# EasyEDA Pro project ProPrj_HTXStudio_OneHanded_Keyboard.epro, schematic 键盘轴_ML

## Sheets
1 keys
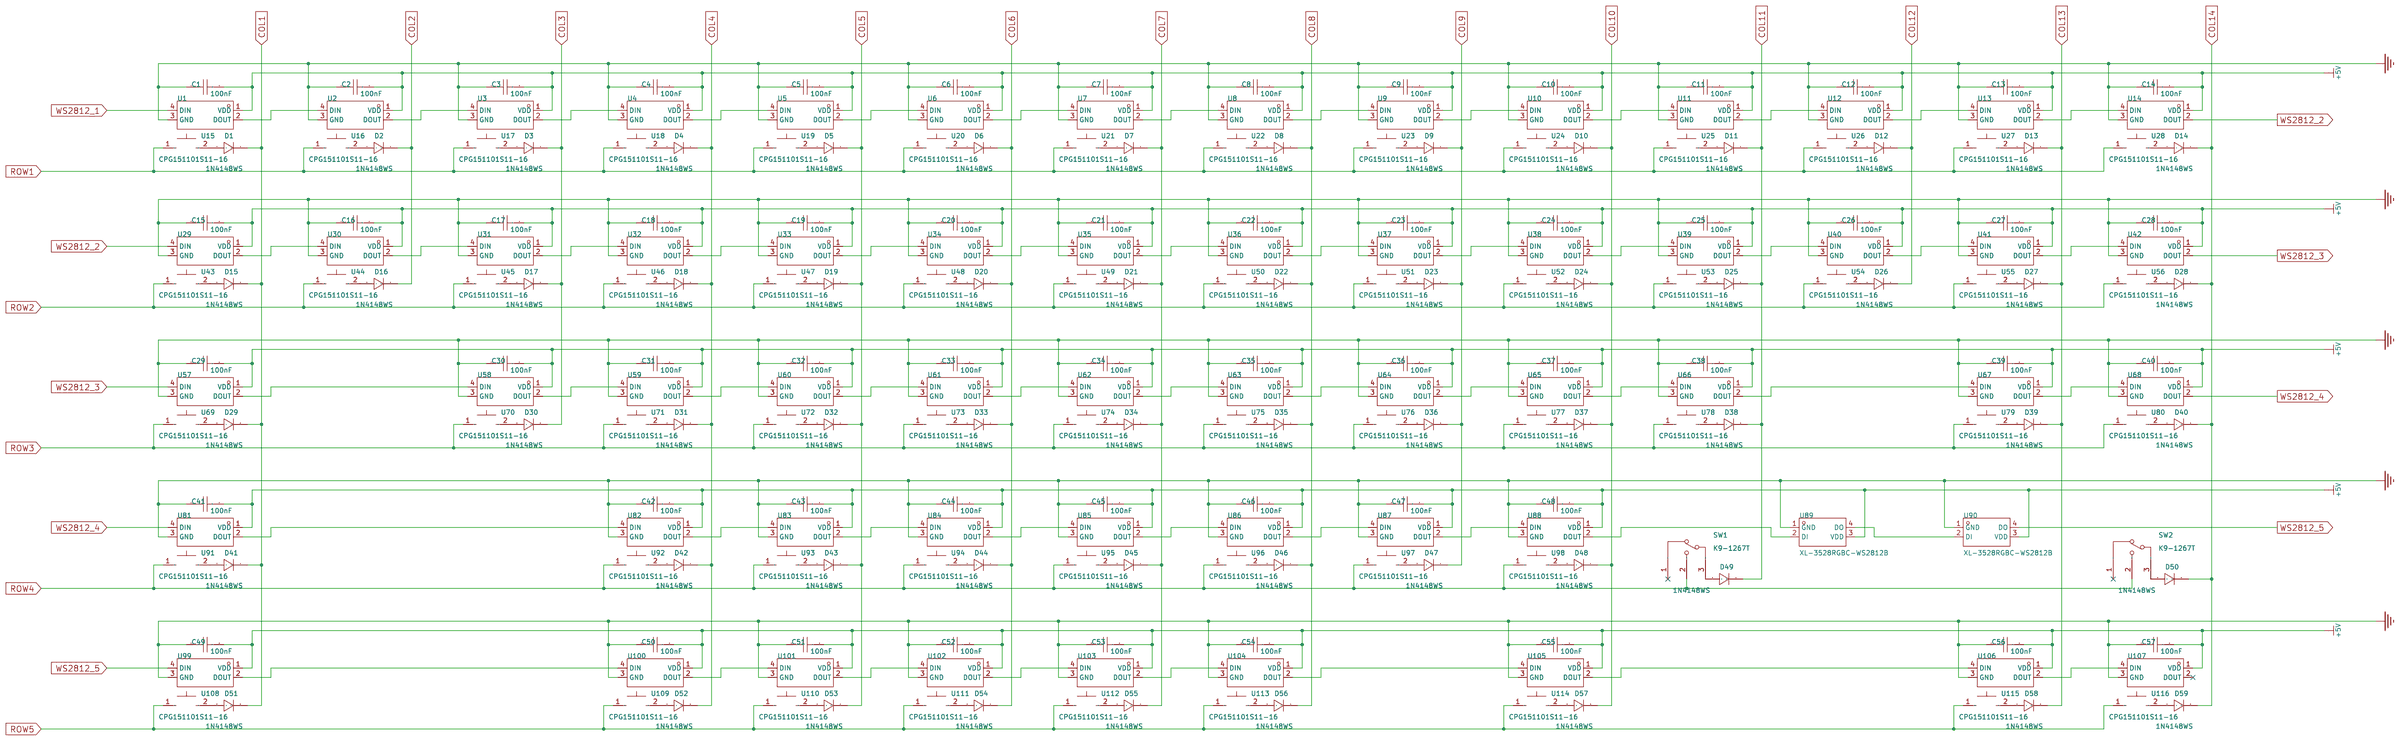
[diagram p5: keys]
2 core
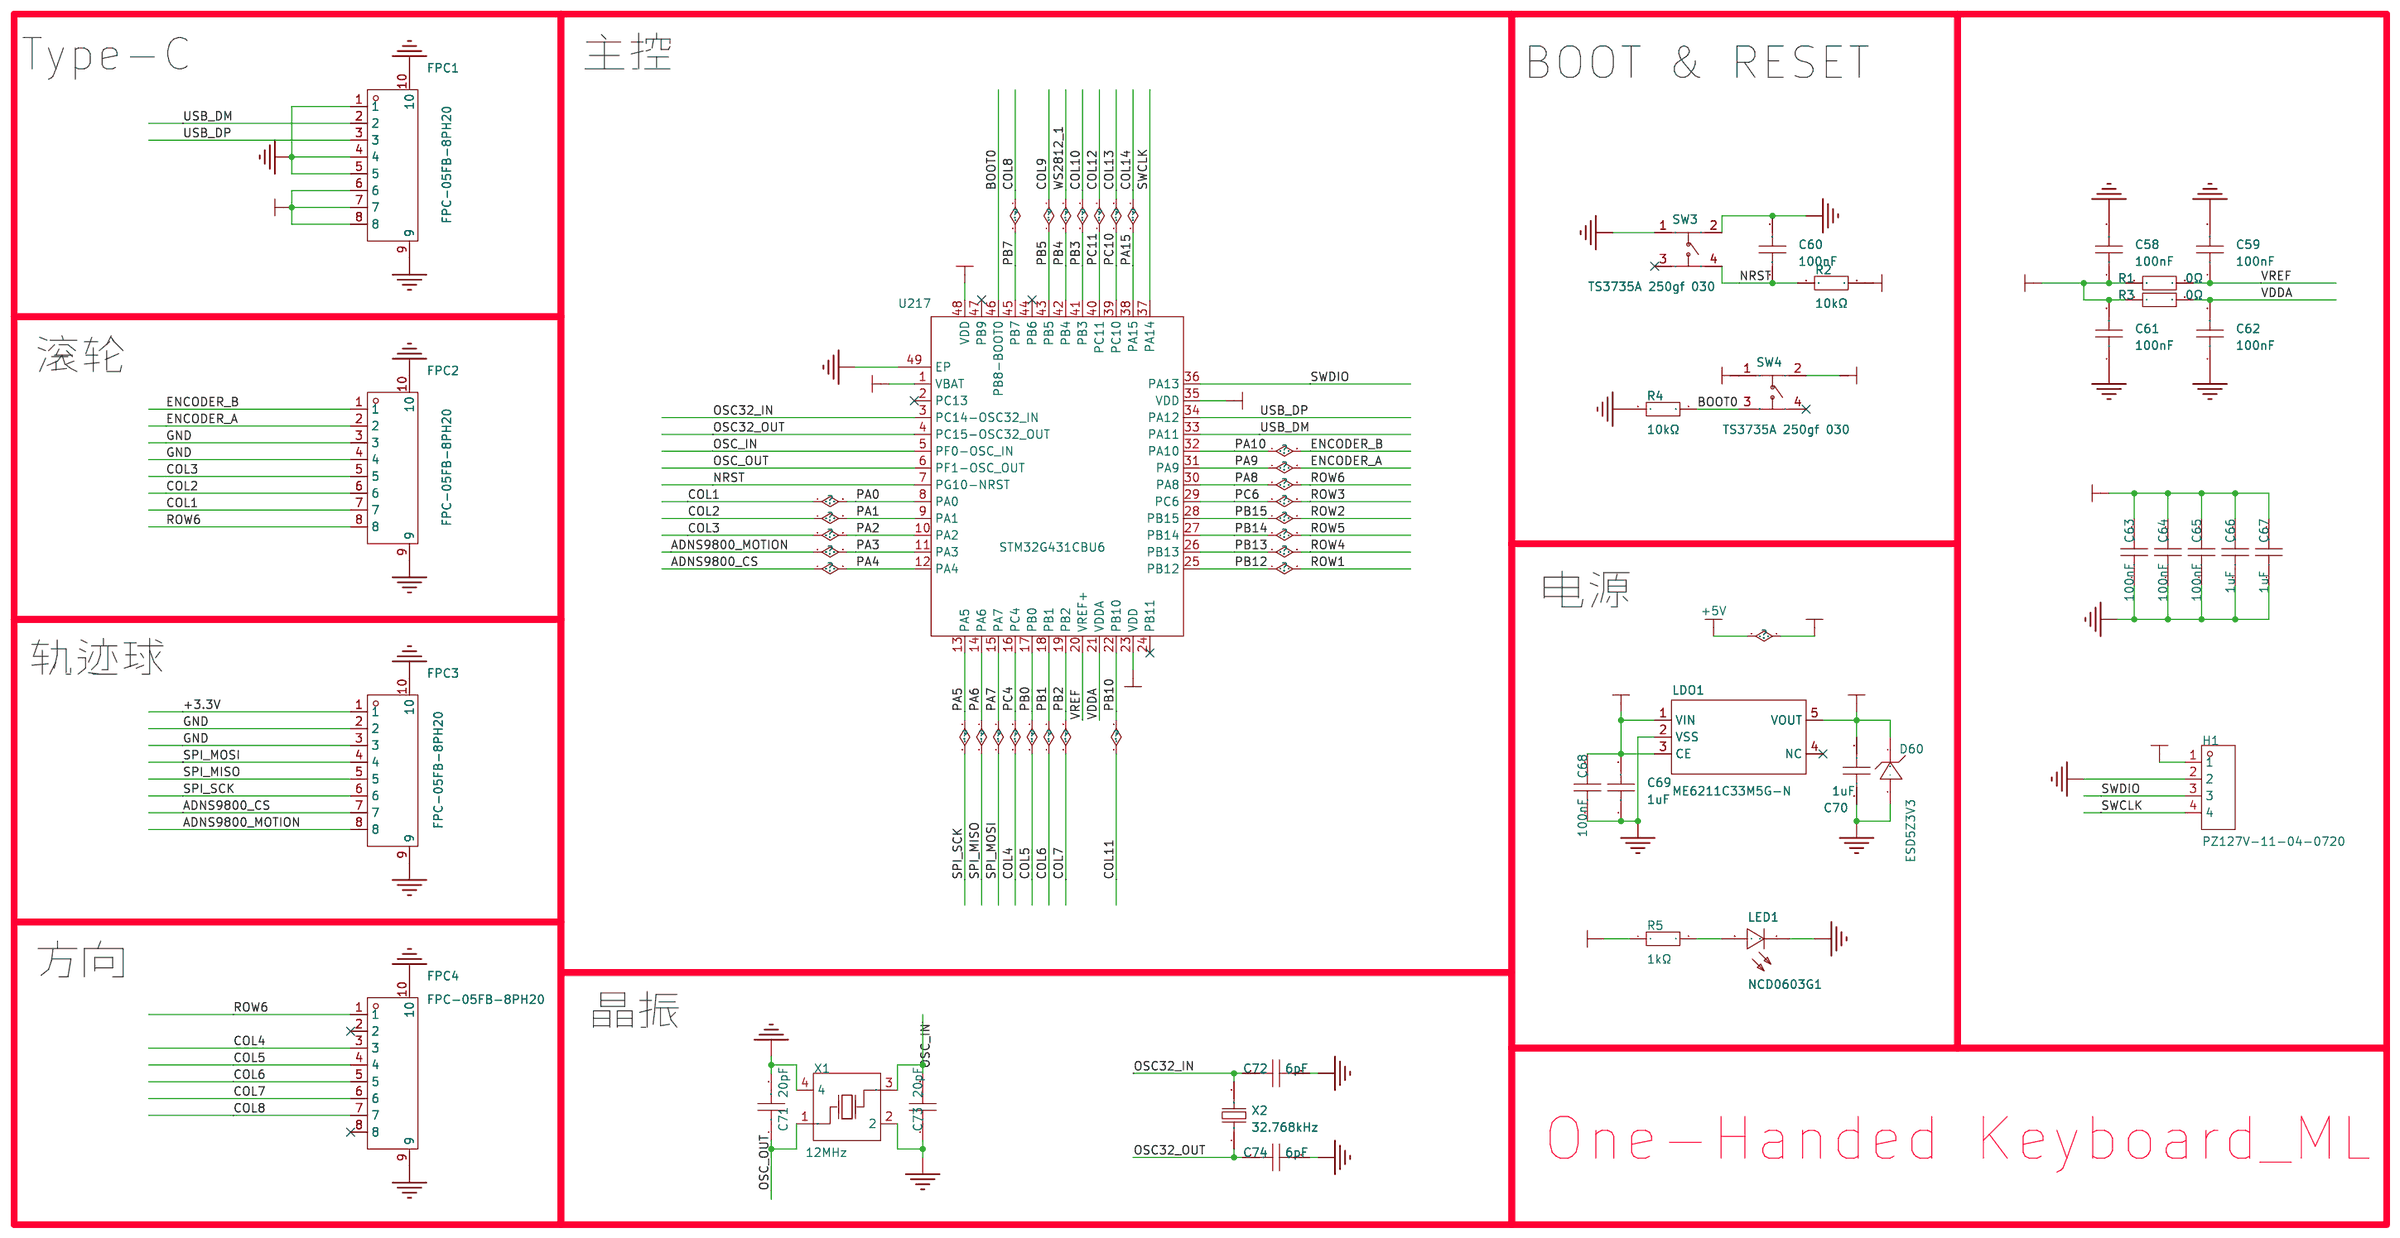
[diagram p6: core]

## Parts
sheet core
C58  100nF  [C0402]
C59  100nF  [C0402]
C60  100nF  [C0402]
C61  100nF  [C0402]
C62  100nF  [C0402]
C63  100nF  [C0402]
C64  100nF  [C0402]
C65  100nF  [C0402]
C66  1uF  [C0402]
C67  1uF  [C0402]
C68  100nF  [C0402]
C69  1uF  [C0402]
C70  1uF  [C0402]
C71  20pF  [C0402]
C72  6pF  [C0402]
C73  20pF  [C0402]
C74  6pF  [C0402]
D60  ESD5Z3V3  [SOD-523_L1.2-W0.8-LS1.6-RD]
FPC1  FPC-05FB-8PH20  [FPC-SMD_8P-P0.50_XUNPU_FPC-05FB-8PH20]
FPC2  FPC-05FB-8PH20  [FPC-SMD_8P-P0.50_XUNPU_FPC-05FB-8PH20]
FPC3  FPC-05FB-8PH20  [FPC-SMD_8P-P0.50_XUNPU_FPC-05FB-8PH20]
FPC4  FPC-05FB-8PH20  [FPC-SMD_8P-P0.50_XUNPU_FPC-05FB-8PH20]
H1  PZ127V-11-04-0720  [HDR-TH_4P-P1.27-V-M]
LDO1  ME6211C33M5G-N  [SOT-23-5_L3.0-W1.7-P0.95-LS2.8-BL]
LED1  NCD0603G1  [LED0603-RD_1]
R1  0Ω  [R0402]
R2  10kΩ  [R0402]
R3  0Ω  [R0402]
R4  10kΩ  [R0402]
R5  1kΩ  [R0402]
SW3  TS3735A 250gf 030  [SW-SMD_4P-L3.7-W3.7-P2.70-LS3.7]
SW4  TS3735A 250gf 030  [SW-SMD_4P-L3.7-W3.7-P2.70-LS3.7]
U217  STM32G431CBU6  [VQFN-48_L7.0-W7.0-P0.50-BL-EP5.5]
X1  12MHz  [OSC-SMD_4P-L2.5-W2.0-BL]
X2  32.768kHz  [FC-135R_L3.2-W1.5]
sheet keys
C1  100nF  [C0603]
C2  100nF  [C0603]
C3  100nF  [C0603]
C4  100nF  [C0603]
C5  100nF  [C0603]
C6  100nF  [C0603]
C7  100nF  [C0603]
C8  100nF  [C0603]
C9  100nF  [C0603]
C10  100nF  [C0603]
C11  100nF  [C0603]
C12  100nF  [C0603]
C13  100nF  [C0603]
C14  100nF  [C0603]
C15  100nF  [C0603]
C16  100nF  [C0603]
C17  100nF  [C0603]
C18  100nF  [C0603]
C19  100nF  [C0603]
C20  100nF  [C0603]
C21  100nF  [C0603]
C22  100nF  [C0603]
C23  100nF  [C0603]
C24  100nF  [C0603]
C25  100nF  [C0603]
C26  100nF  [C0603]
C27  100nF  [C0603]
C28  100nF  [C0603]
C29  100nF  [C0603]
C30  100nF  [C0603]
C31  100nF  [C0603]
C32  100nF  [C0603]
C33  100nF  [C0603]
C34  100nF  [C0603]
C35  100nF  [C0603]
C36  100nF  [C0603]
C37  100nF  [C0603]
C38  100nF  [C0603]
C39  100nF  [C0603]
C40  100nF  [C0603]
C41  100nF  [C0603]
C42  100nF  [C0603]
C43  100nF  [C0603]
C44  100nF  [C0603]
C45  100nF  [C0603]
C46  100nF  [C0603]
C47  100nF  [C0603]
C48  100nF  [C0603]
C49  100nF  [C0603]
C50  100nF  [C0603]
C51  100nF  [C0603]
C52  100nF  [C0603]
C53  100nF  [C0603]
C54  100nF  [C0603]
C55  100nF  [C0603]
C56  100nF  [C0603]
C57  100nF  [C0603]
D1  1N4148WS  [SOD-323_L1.8-W1.3-LS2.5-RD]
D2  1N4148WS  [SOD-323_L1.8-W1.3-LS2.5-RD]
D3  1N4148WS  [SOD-323_L1.8-W1.3-LS2.5-RD]
D4  1N4148WS  [SOD-323_L1.8-W1.3-LS2.5-RD]
D5  1N4148WS  [SOD-323_L1.8-W1.3-LS2.5-RD]
D6  1N4148WS  [SOD-323_L1.8-W1.3-LS2.5-RD]
D7  1N4148WS  [SOD-323_L1.8-W1.3-LS2.5-RD]
D8  1N4148WS  [SOD-323_L1.8-W1.3-LS2.5-RD]
D9  1N4148WS  [SOD-323_L1.8-W1.3-LS2.5-RD]
D10  1N4148WS  [SOD-323_L1.8-W1.3-LS2.5-RD]
D11  1N4148WS  [SOD-323_L1.8-W1.3-LS2.5-RD]
D12  1N4148WS  [SOD-323_L1.8-W1.3-LS2.5-RD]
D13  1N4148WS  [SOD-323_L1.8-W1.3-LS2.5-RD]
D14  1N4148WS  [SOD-323_L1.8-W1.3-LS2.5-RD]
D15  1N4148WS  [SOD-323_L1.8-W1.3-LS2.5-RD]
D16  1N4148WS  [SOD-323_L1.8-W1.3-LS2.5-RD]
D17  1N4148WS  [SOD-323_L1.8-W1.3-LS2.5-RD]
D18  1N4148WS  [SOD-323_L1.8-W1.3-LS2.5-RD]
D19  1N4148WS  [SOD-323_L1.8-W1.3-LS2.5-RD]
D20  1N4148WS  [SOD-323_L1.8-W1.3-LS2.5-RD]
D21  1N4148WS  [SOD-323_L1.8-W1.3-LS2.5-RD]
D22  1N4148WS  [SOD-323_L1.8-W1.3-LS2.5-RD]
D23  1N4148WS  [SOD-323_L1.8-W1.3-LS2.5-RD]
D24  1N4148WS  [SOD-323_L1.8-W1.3-LS2.5-RD]
D25  1N4148WS  [SOD-323_L1.8-W1.3-LS2.5-RD]
D26  1N4148WS  [SOD-323_L1.8-W1.3-LS2.5-RD]
D27  1N4148WS  [SOD-323_L1.8-W1.3-LS2.5-RD]
D28  1N4148WS  [SOD-323_L1.8-W1.3-LS2.5-RD]
D29  1N4148WS  [SOD-323_L1.8-W1.3-LS2.5-RD]
D30  1N4148WS  [SOD-323_L1.8-W1.3-LS2.5-RD]
D31  1N4148WS  [SOD-323_L1.8-W1.3-LS2.5-RD]
D32  1N4148WS  [SOD-323_L1.8-W1.3-LS2.5-RD]
D33  1N4148WS  [SOD-323_L1.8-W1.3-LS2.5-RD]
D34  1N4148WS  [SOD-323_L1.8-W1.3-LS2.5-RD]
D35  1N4148WS  [SOD-323_L1.8-W1.3-LS2.5-RD]
D36  1N4148WS  [SOD-323_L1.8-W1.3-LS2.5-RD]
D37  1N4148WS  [SOD-323_L1.8-W1.3-LS2.5-RD]
D38  1N4148WS  [SOD-323_L1.8-W1.3-LS2.5-RD]
D39  1N4148WS  [SOD-323_L1.8-W1.3-LS2.5-RD]
D40  1N4148WS  [SOD-323_L1.8-W1.3-LS2.5-RD]
D41  1N4148WS  [SOD-323_L1.8-W1.3-LS2.5-RD]
D42  1N4148WS  [SOD-323_L1.8-W1.3-LS2.5-RD]
D43  1N4148WS  [SOD-323_L1.8-W1.3-LS2.5-RD]
D44  1N4148WS  [SOD-323_L1.8-W1.3-LS2.5-RD]
D45  1N4148WS  [SOD-323_L1.8-W1.3-LS2.5-RD]
D46  1N4148WS  [SOD-323_L1.8-W1.3-LS2.5-RD]
D47  1N4148WS  [SOD-323_L1.8-W1.3-LS2.5-RD]
D48  1N4148WS  [SOD-323_L1.8-W1.3-LS2.5-RD]
D49  1N4148WS  [SOD-323_L1.8-W1.3-LS2.5-RD]
D50  1N4148WS  [SOD-323_L1.8-W1.3-LS2.5-RD]
D51  1N4148WS  [SOD-323_L1.8-W1.3-LS2.5-RD]
D52  1N4148WS  [SOD-323_L1.8-W1.3-LS2.5-RD]
D53  1N4148WS  [SOD-323_L1.8-W1.3-LS2.5-RD]
D54  1N4148WS  [SOD-323_L1.8-W1.3-LS2.5-RD]
D55  1N4148WS  [SOD-323_L1.8-W1.3-LS2.5-RD]
D56  1N4148WS  [SOD-323_L1.8-W1.3-LS2.5-RD]
D57  1N4148WS  [SOD-323_L1.8-W1.3-LS2.5-RD]
D58  1N4148WS  [SOD-323_L1.8-W1.3-LS2.5-RD]
D59  1N4148WS  [SOD-323_L1.8-W1.3-LS2.5-RD]
SW1  K9-1267T  [SW-TH_K9-1267T]
SW2  K9-1267T  [SW-TH_K9-1267T]
U1  Yo-WS2812B-3528反贴雾状  [LED-SMD_L3.2-W2.8_YO-WS2812B-3528]
U2  Yo-WS2812B-3528反贴雾状  [LED-SMD_L3.2-W2.8_YO-WS2812B-3528]
U3  Yo-WS2812B-3528反贴雾状  [LED-SMD_L3.2-W2.8_YO-WS2812B-3528]
U4  Yo-WS2812B-3528反贴雾状  [LED-SMD_L3.2-W2.8_YO-WS2812B-3528]
U5  Yo-WS2812B-3528反贴雾状  [LED-SMD_L3.2-W2.8_YO-WS2812B-3528]
U6  Yo-WS2812B-3528反贴雾状  [LED-SMD_L3.2-W2.8_YO-WS2812B-3528]
U7  Yo-WS2812B-3528反贴雾状  [LED-SMD_L3.2-W2.8_YO-WS2812B-3528]
U8  Yo-WS2812B-3528反贴雾状  [LED-SMD_L3.2-W2.8_YO-WS2812B-3528]
U9  Yo-WS2812B-3528反贴雾状  [LED-SMD_L3.2-W2.8_YO-WS2812B-3528]
U10  Yo-WS2812B-3528反贴雾状  [LED-SMD_L3.2-W2.8_YO-WS2812B-3528]
U11  Yo-WS2812B-3528反贴雾状  [LED-SMD_L3.2-W2.8_YO-WS2812B-3528]
U12  Yo-WS2812B-3528反贴雾状  [LED-SMD_L3.2-W2.8_YO-WS2812B-3528]
U13  Yo-WS2812B-3528反贴雾状  [LED-SMD_L3.2-W2.8_YO-WS2812B-3528]
U14  Yo-WS2812B-3528反贴雾状  [LED-SMD_L3.2-W2.8_YO-WS2812B-3528]
U15  CPG151101S11-16  [SMD_KEYBOARD-SW]
U16  CPG151101S11-16  [SMD_KEYBOARD-SW]
U17  CPG151101S11-16  [SMD_KEYBOARD-SW]
U18  CPG151101S11-16  [SMD_KEYBOARD-SW]
U19  CPG151101S11-16  [SMD_KEYBOARD-SW]
U20  CPG151101S11-16  [SMD_KEYBOARD-SW]
U21  CPG151101S11-16  [SMD_KEYBOARD-SW]
U22  CPG151101S11-16  [SMD_KEYBOARD-SW]
U23  CPG151101S11-16  [SMD_KEYBOARD-SW]
U24  CPG151101S11-16  [SMD_KEYBOARD-SW]
U25  CPG151101S11-16  [SMD_KEYBOARD-SW]
U26  CPG151101S11-16  [SMD_KEYBOARD-SW]
U27  CPG151101S11-16  [SMD_KEYBOARD-SW]
U28  CPG151101S11-16  [SMD_KEYBOARD-SW]
U29  Yo-WS2812B-3528反贴雾状  [LED-SMD_L3.2-W2.8_YO-WS2812B-3528]
U30  Yo-WS2812B-3528反贴雾状  [LED-SMD_L3.2-W2.8_YO-WS2812B-3528]
U31  Yo-WS2812B-3528反贴雾状  [LED-SMD_L3.2-W2.8_YO-WS2812B-3528]
U32  Yo-WS2812B-3528反贴雾状  [LED-SMD_L3.2-W2.8_YO-WS2812B-3528]
U33  Yo-WS2812B-3528反贴雾状  [LED-SMD_L3.2-W2.8_YO-WS2812B-3528]
U34  Yo-WS2812B-3528反贴雾状  [LED-SMD_L3.2-W2.8_YO-WS2812B-3528]
U35  Yo-WS2812B-3528反贴雾状  [LED-SMD_L3.2-W2.8_YO-WS2812B-3528]
U36  Yo-WS2812B-3528反贴雾状  [LED-SMD_L3.2-W2.8_YO-WS2812B-3528]
U37  Yo-WS2812B-3528反贴雾状  [LED-SMD_L3.2-W2.8_YO-WS2812B-3528]
U38  Yo-WS2812B-3528反贴雾状  [LED-SMD_L3.2-W2.8_YO-WS2812B-3528]
U39  Yo-WS2812B-3528反贴雾状  [LED-SMD_L3.2-W2.8_YO-WS2812B-3528]
U40  Yo-WS2812B-3528反贴雾状  [LED-SMD_L3.2-W2.8_YO-WS2812B-3528]
U41  Yo-WS2812B-3528反贴雾状  [LED-SMD_L3.2-W2.8_YO-WS2812B-3528]
U42  Yo-WS2812B-3528反贴雾状  [LED-SMD_L3.2-W2.8_YO-WS2812B-3528]
U43  CPG151101S11-16  [SMD_KEYBOARD-SW]
U44  CPG151101S11-16  [SMD_KEYBOARD-SW]
U45  CPG151101S11-16  [SMD_KEYBOARD-SW]
U46  CPG151101S11-16  [SMD_KEYBOARD-SW]
U47  CPG151101S11-16  [SMD_KEYBOARD-SW]
U48  CPG151101S11-16  [SMD_KEYBOARD-SW]
U49  CPG151101S11-16  [SMD_KEYBOARD-SW]
U50  CPG151101S11-16  [SMD_KEYBOARD-SW]
U51  CPG151101S11-16  [SMD_KEYBOARD-SW]
U52  CPG151101S11-16  [SMD_KEYBOARD-SW]
U53  CPG151101S11-16  [SMD_KEYBOARD-SW]
U54  CPG151101S11-16  [SMD_KEYBOARD-SW]
U55  CPG151101S11-16  [SMD_KEYBOARD-SW]
U56  CPG151101S11-16  [SMD_KEYBOARD-SW]
U57  Yo-WS2812B-3528反贴雾状  [LED-SMD_L3.2-W2.8_YO-WS2812B-3528]
U58  Yo-WS2812B-3528反贴雾状  [LED-SMD_L3.2-W2.8_YO-WS2812B-3528]
U59  Yo-WS2812B-3528反贴雾状  [LED-SMD_L3.2-W2.8_YO-WS2812B-3528]
U60  Yo-WS2812B-3528反贴雾状  [LED-SMD_L3.2-W2.8_YO-WS2812B-3528]
U61  Yo-WS2812B-3528反贴雾状  [LED-SMD_L3.2-W2.8_YO-WS2812B-3528]
U62  Yo-WS2812B-3528反贴雾状  [LED-SMD_L3.2-W2.8_YO-WS2812B-3528]
U63  Yo-WS2812B-3528反贴雾状  [LED-SMD_L3.2-W2.8_YO-WS2812B-3528]
U64  Yo-WS2812B-3528反贴雾状  [LED-SMD_L3.2-W2.8_YO-WS2812B-3528]
U65  Yo-WS2812B-3528反贴雾状  [LED-SMD_L3.2-W2.8_YO-WS2812B-3528]
U66  Yo-WS2812B-3528反贴雾状  [LED-SMD_L3.2-W2.8_YO-WS2812B-3528]
U67  Yo-WS2812B-3528反贴雾状  [LED-SMD_L3.2-W2.8_YO-WS2812B-3528]
U68  Yo-WS2812B-3528反贴雾状  [LED-SMD_L3.2-W2.8_YO-WS2812B-3528]
U69  CPG151101S11-16  [SMD_KEYBOARD-SW]
U70  CPG151101S11-16  [SMD_KEYBOARD-SW]
U71  CPG151101S11-16  [SMD_KEYBOARD-SW]
U72  CPG151101S11-16  [SMD_KEYBOARD-SW]
U73  CPG151101S11-16  [SMD_KEYBOARD-SW]
U74  CPG151101S11-16  [SMD_KEYBOARD-SW]
U75  CPG151101S11-16  [SMD_KEYBOARD-SW]
U76  CPG151101S11-16  [SMD_KEYBOARD-SW]
U77  CPG151101S11-16  [SMD_KEYBOARD-SW]
U78  CPG151101S11-16  [SMD_KEYBOARD-SW]
U79  CPG151101S11-16  [SMD_KEYBOARD-SW]
U80  CPG151101S11-16  [SMD_KEYBOARD-SW]
U81  Yo-WS2812B-3528反贴雾状  [LED-SMD_L3.2-W2.8_YO-WS2812B-3528]
U82  Yo-WS2812B-3528反贴雾状  [LED-SMD_L3.2-W2.8_YO-WS2812B-3528]
U83  Yo-WS2812B-3528反贴雾状  [LED-SMD_L3.2-W2.8_YO-WS2812B-3528]
U84  Yo-WS2812B-3528反贴雾状  [LED-SMD_L3.2-W2.8_YO-WS2812B-3528]
U85  Yo-WS2812B-3528反贴雾状  [LED-SMD_L3.2-W2.8_YO-WS2812B-3528]
U86  Yo-WS2812B-3528反贴雾状  [LED-SMD_L3.2-W2.8_YO-WS2812B-3528]
U87  Yo-WS2812B-3528反贴雾状  [LED-SMD_L3.2-W2.8_YO-WS2812B-3528]
U88  Yo-WS2812B-3528反贴雾状  [LED-SMD_L3.2-W2.8_YO-WS2812B-3528]
U89  XL-3528RGBC-WS2812B  [LED-SMD_4P-L3.5-W2.8-BR-1]
U90  XL-3528RGBC-WS2812B  [LED-SMD_4P-L3.5-W2.8-BR-1]
U91  CPG151101S11-16  [SMD_KEYBOARD-SW]
U92  CPG151101S11-16  [SMD_KEYBOARD-SW]
U93  CPG151101S11-16  [SMD_KEYBOARD-SW]
U94  CPG151101S11-16  [SMD_KEYBOARD-SW]
U95  CPG151101S11-16  [SMD_KEYBOARD-SW]
U96  CPG151101S11-16  [SMD_KEYBOARD-SW]
U97  CPG151101S11-16  [SMD_KEYBOARD-SW]
U98  CPG151101S11-16  [SMD_KEYBOARD-SW]
U99  Yo-WS2812B-3528反贴雾状  [LED-SMD_L3.2-W2.8_YO-WS2812B-3528]
U100  Yo-WS2812B-3528反贴雾状  [LED-SMD_L3.2-W2.8_YO-WS2812B-3528]
U101  Yo-WS2812B-3528反贴雾状  [LED-SMD_L3.2-W2.8_YO-WS2812B-3528]
U102  Yo-WS2812B-3528反贴雾状  [LED-SMD_L3.2-W2.8_YO-WS2812B-3528]
U103  Yo-WS2812B-3528反贴雾状  [LED-SMD_L3.2-W2.8_YO-WS2812B-3528]
U104  Yo-WS2812B-3528反贴雾状  [LED-SMD_L3.2-W2.8_YO-WS2812B-3528]
U105  Yo-WS2812B-3528反贴雾状  [LED-SMD_L3.2-W2.8_YO-WS2812B-3528]
U106  Yo-WS2812B-3528反贴雾状  [LED-SMD_L3.2-W2.8_YO-WS2812B-3528]
U107  Yo-WS2812B-3528反贴雾状  [LED-SMD_L3.2-W2.8_YO-WS2812B-3528]
U108  CPG151101S11-16  [SMD_KEYBOARD-SW]
U109  CPG151101S11-16  [SMD_KEYBOARD-SW]
U110  CPG151101S11-16  [SMD_KEYBOARD-SW]
U111  CPG151101S11-16  [SMD_KEYBOARD-SW]
U112  CPG151101S11-16  [SMD_KEYBOARD-SW]
U113  CPG151101S11-16  [SMD_KEYBOARD-SW]
U114  CPG151101S11-16  [SMD_KEYBOARD-SW]
U115  CPG151101S11-16  [SMD_KEYBOARD-SW]
U116  CPG151101S11-16  [SMD_KEYBOARD-SW]

## Library data of the parts
C58-C65 C68 = CL05B104KB54PNC: 容值:100nF;精度:±10%;额定电压:50V;材质(温度系数):X7R;; LCSC Part Name: 100nF ±10% 50V; Supplier Part: C307331; Manufacturer: SAMSUNG(三星); Supplier Footprint: 0402; JLCPCB Part Class: 基础库; Datasheet: https://atta.szlcsc.com/upload/public/pdf/source/20160218/1457707763339.pdf; Supplier: LCSC; Tolerance: ±10%; Voltage Rated: 50V; Temperature Coefficient: X7R
C66 C67 C69 C70 = CL05A105KA5NQNC: 容值:1uF;精度:±10%;额定电压:25V;材质(温度系数):X5R;; LCSC Part Name: 1uF ±10% 25V; Supplier Part: C52923; Manufacturer: SAMSUNG(三星); Supplier Footprint: 0402; JLCPCB Part Class: Basic Part; Datasheet: https://atta.szlcsc.com/upload/public/pdf/source/20160218/1457707763339.pdf; Supplier: LCSC; Tolerance: ±10%; Voltage Rated: 25V; Temperature Coefficient: X5R
C71 C73 = GRM1555C1H200JA01D: 容值:20pF;精度:±5%;额定电压:50V;材质(温度系数):C0G;; LCSC Part Name: 20pF ±5% 50V; Supplier Part: C76959; Manufacturer: muRata(村田); Supplier Footprint: 0402; JLCPCB Part Class: 扩展库; Datasheet: https://atta.szlcsc.com/upload/public/pdf/source/20180307/C76959_15204091273971407747.pdf; Supplier: LCSC; Tolerance: ±5%; Voltage Rated: 50V; Temperature Coefficient: C0G
C72 C74 = GJM1555C1H6R0WB01D: 容值:6pF;额定电压:50V;材质(温度系数):C0G;; LCSC Part Name: 6pF 50V; Supplier Part: C882557; Manufacturer: muRata(村田); Supplier Footprint: 0402; JLCPCB Part Class: 扩展库; Datasheet: https://atta.szlcsc.com/upload/public/pdf/source/20201228/C882557_CC42579B2F91491CB41A68597C1310CF.pdf; Supplier: LCSC; Voltage Rated: 50V; Temperature Coefficient: C0G
D60 = ESD5Z3V3_C2841409: +3.3V; Supplier Part: C2841409; Manufacturer: TECH PUBLIC(台舟); Supplier Footprint: SOD-523; JLCPCB Part Class: 扩展库; Datasheet: https://atta.szlcsc.com/upload/public/pdf/source/20211010/C2841409_E778AEF8B577E7561120661F012F3EB1.pdf; Supplier: LCSC; polarity: 单向; Reverse Stand-Off Voltage (Vrwm): +3.3V; Maximum Clamping Voltage: 14V; Breakdown Voltage: 5V; Reverse Leakage Current (Ir): 200nA; Number of Lines: 单路
FPC1-FPC4 = FPC-05FB-8PH20: 锁定特性:翻盖式;触点类型:双侧触点/上下接;触点数量:8P;间距:0.5mm;安装类型:卧贴;工作温度范围:-25℃~+85℃;; LCSC Part Name: 间距:0.5mm P数:8P 翻盖式 双侧触点/上下接; Supplier Part: C2856828; Manufacturer: XUNPU(讯普); Supplier Footprint: SMD,P=0.5mm,卧贴; JLCPCB Part Class: 扩展库; Datasheet: https://atta.szlcsc.com/upload/public/pdf/source/20210922/C2856828_96968FB666CC1781EEE4F204CBA73B0B.pdf; Supplier: LCSC; Locking Feature: 翻盖式; Contact Type: 双侧触点/上下接; Number of Contacts: 8P; Pitch: 0.5mm; Mounting Type: 卧贴; FFC, FCB Thickness: 0.3mm; Height Above Board: 2mm; Operating Temperature Range: -25℃~+85℃
H1 = PZ127V-11-04-0720: 插针结构:1x4P;间距:1.27mm;行距:-;圆针/方针:-;安装类型:直插;排数:单排;总PIN位数:4P;额定电流:-;额定电压:-;配合针长度:3.9mm;塑高:1mm;端接针长度:2.3mm;触头材质:黄铜;触头镀层:-;工作温度范围:-40℃~+105℃;焊接温度(最大值):-;颜色:黑色;; LCSC Part Name: 间距:1.27mm 1x4P 直插; Supplier Part: C541879; Manufacturer: XFCN(兴飞); Supplier Footprint: 插件,P=1.27mm; JLCPCB Part Class: 扩展库; Datasheet: https://atta.szlcsc.com/upload/public/pdf/source/20200519/C541879_5CD99C402ABEE613587AE88FBA356357.pdf; Supplier: LCSC; Pin Structure: 1x4P; Pitch: 1.27mm; Mounting Type: 直插; Number of Rows: 单排; Number of Pins: 4P; Length of Mating Pin: 3.9mm; Insulation Height: 1mm; Length of End Connection Pin: 2.3mm; Contact Material: 黄铜; Operating Temperature Range: -40℃~+105℃; Color: 黑色
LDO1 = ME6211C33M5G-N: 输出类型:固定;工作电压:6V;输出电压:3.3V;输出电流:500mA;电源纹波抑制比(PSRR):70dB@(1kHz)；62dB@(10kHz);输出极性:正极;; LCSC Part Name: 输入6V 输出3.3V 500mA; Supplier Part: C82942; Manufacturer: MICRONE(南京微盟); Supplier Footprint: SOT-23-5; JLCPCB Part Class: 扩展库; Datasheet: https://atta.szlcsc.com/upload/public/pdf/source/20170918/C82942_1505727073070976520.pdf; Supplier: LCSC; Output Type: 固定; Voltage - Supply: 6V; Output Voltage: 3.3V; Output Current: 500mA; Power Supply Rejection Ratio (PSRR): 70dB@(1kHz)；62dB@(10kHz); Voltage Dropout: 260mV@(200mA); Features: 短路保护(SCP)；低ESR；过流保护(OCP)；带使能; Output Configuration: 正极; Number of Outputs: 1
LED1 = NCD0603G1: 发光颜色:翠绿色;正向电压(VF):2.6V~3.6V;功率:72mW;正向电流:10mA;主波长:515nm~530nm;透镜颜色:无色透明透镜;发光强度:330mcd~900mcd;发光角度:130°;工作温度:-30℃~+85℃;; Supplier Part: C84267; Manufacturer: 国星光电; Supplier Footprint: 0603; JLCPCB Part Class: 扩展库; Datasheet: https://atta.szlcsc.com/upload/public/pdf/source/20200820/C84267_04BA7703640BAC111D09F5EFB971FBF3.pdf; Supplier: LCSC; Emitted Color: 翠绿色; Forward Voltage (VF): 2.6V~3.6V; Power Dissipation: 72mW; Forward Current: 10mA; Dominant Wavelength: 515nm~530nm; Lens Color: 无色透明透镜; Luminous Intensity: 330mcd~900mcd; Viewing Angle: 130°; Operating Temperature: -30℃~+85℃
R1 R3 = 0402WGF0000TCE: 电阻类型:厚膜电阻;阻值:0Ω;精度:±1%;功率:62.5mW;最大工作电压:50V;温度系数:±800ppm/℃;; LCSC Part Name: 0Ω ±1% 62.5mW 厚膜电阻; Supplier Part: C17168; Manufacturer: UNI-ROYAL(厚声); Supplier Footprint: 0402; JLCPCB Part Class: Basic Part; Datasheet: https://atta.szlcsc.com/upload/public/pdf/source/20200306/C422600_1E6D84923E4A46A82E41ADD87F860B5C.pdf; Supplier: LCSC; Type: 厚膜电阻; Tolerance: ±1%; Power(Watts): 62.5mW; Overload Voltage (Max): 50V; Temperature Coefficient: ±800ppm/℃; Operating Temperature Range: -55℃~+155℃
R2 R4 = 0402WGF1002TCE: 电阻类型:厚膜电阻;阻值:10kΩ;精度:±1%;功率:62.5mW;最大工作电压:50V;温度系数:±100ppm/℃;; LCSC Part Name: 10kΩ ±1% 62.5mW 厚膜电阻; Supplier Part: C25744; Manufacturer: UNI-ROYAL(厚声); Supplier Footprint: 0402; JLCPCB Part Class: 基础库; Datasheet: https://atta.szlcsc.com/upload/public/pdf/source/20200306/C422600_1E6D84923E4A46A82E41ADD87F860B5C.pdf; Supplier: LCSC; Type: 厚膜电阻; Tolerance: ±1%; Power(Watts): 62.5mW; Overload Voltage (Max): 50V; Temperature Coefficient: ±100ppm/℃; Operating Temperature Range: -55℃~+155℃
R5 = 0402WGF1001TCE: 电阻类型:厚膜电阻;阻值:1kΩ;精度:±1%;功率:62.5mW;最大工作电压:50V;温度系数:±100ppm/℃;; LCSC Part Name: 1kΩ ±1% 62.5mW 厚膜电阻; Supplier Part: C11702; Manufacturer: UNI-ROYAL(厚声); Supplier Footprint: 0402; JLCPCB Part Class: Basic Part; Datasheet: https://atta.szlcsc.com/upload/public/pdf/source/20200306/C422600_1E6D84923E4A46A82E41ADD87F860B5C.pdf; Supplier: LCSC; Type: 厚膜电阻; Tolerance: ±1%; Power(Watts): 62.5mW; Overload Voltage (Max): 50V; Temperature Coefficient: ±100ppm/℃; Operating Temperature Range: -55℃~+155℃
SW3 SW4 = TS3735A 250gf 030: 电路结构:单刀单掷;按钮形状:圆形按钮;作用力:2.5N;安装方式:立贴;开关长度:3.7mm;开关宽度:3.7mm;开关高度:0.35mm;带支架:不带;触点电流:50mA;额定电压(DC):12V;绝缘电阻:100MΩ;机械寿命:3万次;; LCSC Part Name: 3.7*3.7*0.35mm 立贴 轻触开关; Supplier Part: C2906282; Manufacturer: SHOU HAN(首韩); Supplier Footprint: SMD; JLCPCB Part Class: 扩展库; Datasheet: https://atta.szlcsc.com/upload/public/pdf/source/20211019/126A9D1EE678E2ED4D7ADF984A8B9751.pdf; Supplier: LCSC; Circuit: 单刀单掷; Actuator Style: 圆形按钮; Operating Force: 2.5N; Mounting Style: 立贴; Switch Length: 3.7mm; Switch Width: 3.7mm; Switch Height: 0.35mm; Strike Gundam: 不带; Contact Current: 50mA; Voltage Rating (DC): 12V; Insulation Resistance: 100MΩ; Actuator/Cap Color: 黄色; Pin Style: SMD接片; Mechanical Life: 3万次; Operating Temperature: -20℃~+70℃
U217 = STM32G431CBU6: CPU内核:ARM-M系列;CPU最大主频:170MHz;应用领域:-;; LCSC Part Name: 带DSP和FPU的170MHz主流ARM Cortex-M4 MCU，具有128 KB Flash存储器、数学加速器和中等模拟电平集成; Supplier Part: C529356; Manufacturer: ST(意法半导体); Supplier Footprint: UFQFPN-48(7x7); JLCPCB Part Class: Extended Part; Datasheet: https://atta.szlcsc.com/upload/public/pdf/source/20200511/C529354_7C66CF00837B904D0C15DCE45B69418C.pdf; Supplier: LCSC; CPU Core: ARM-M系列; CPU Maximum Speed: 170MHz; Program Storage Size: 128KB; Program Memory Type: FLASH; Number of I/O: 42; ADC (Bit): 12bit; DAC (Bit): 12bit; Low Voltage Detection Threshold: 1.71V~3.6V
X1 = TXM12M0004252FBCEO00T: 晶振类型:贴片晶振;频率:12MHz;常温频差:±10ppm;外接负载电容:12pF;频率稳定度(全温):±30ppm;; LCSC Part Name: 12MHz ±10ppm 12pF; Supplier Part: C284155; Manufacturer: YJX(雅晶鑫); Supplier Footprint: SMD2520-4P; JLCPCB Part Class: 扩展库; Datasheet: https://atta.szlcsc.com/upload/public/pdf/source/20180910/C284155_B9AC3CB548367C19CE747B551130DB15.pdf; Supplier: LCSC; Crystal Type: 贴片晶振; Normal temperature Frequency Tolerance: ±10ppm; External load capacitor: 12pF; Frequency Stability(Full temperature range): ±30ppm; Equivalent Series Resistance (ESR): 120Ω; Operating Temperature: -40℃~+85℃
X2 = Q13FC13500004_C32346: 晶振类型:贴片晶振;频率:32.768kHz;常温频差:±20ppm;负载电容:12.5pF;; LCSC Part Name: 32.768kHz ±20ppm 12.5pF; Supplier Part: C32346; Manufacturer: EPSON(爱普生); Manufacturer Part: Q13FC13500004; Supplier Footprint: SMD3215-2P; JLCPCB Part Class: 基础库; Datasheet: https://atta.szlcsc.com/upload/public/pdf/source/20240418/0E0FF5F0356BA3753F616001439D1416.pdf; Supplier: LCSC; Crystal Type: 贴片晶振; Normal temperature Frequency Tolerance: ±20ppm; Load Capacitor: 12.5pF; Equivalent Series Resistance (ESR): 70kΩ; Operating Temperature: -40℃~+85℃
C1-C57 = CC0603KRX7R9BB104: 容值:100nF;精度:±10%;额定电压:50V;材质(温度系数):X7R;; LCSC Part Name: 100nF ±10% 50V; Supplier Part: C14663; Manufacturer: YAGEO(国巨); Supplier Footprint: 0603; JLCPCB Part Class: 基础库; Datasheet: https://atta.szlcsc.com/upload/public/pdf/source/20180910/C282072_33301C7F631E79921B82A8DAC6BCC5B3.pdf; Supplier: LCSC; Tolerance: ±10%; Voltage Rated: 50V; Temperature Coefficient: X7R
D1-D48 D51-D59 = 1N4148WS_C2128: 二极管配置:独立式;正向压降(Vf):1.25V@150mA;直流反向耐压(Vr):100V;整流电流:150mA;反向恢复时间(trr):4ns;; LCSC Part Name: 丝印T4; Supplier Part: C2128; Manufacturer: CJ(江苏长电/长晶); Supplier Footprint: SOD-323; JLCPCB Part Class: 基础库; Datasheet: https://atta.szlcsc.com/upload/public/pdf/source/20140809/1457707208178.pdf; Supplier: LCSC; Diode Configuration: 独立式; Forward Voltage (Vf@If): 1.25V@150mA; Reverse Voltage (Vr): 100V; Rectified Current: 150mA; Reverse Leakage Current (Ir): 1uA@75V; Reverse Recovery Time (trr): 4ns
D49 D50 = 1N4148WS_C437156: 二极管配置:独立式;正向压降(Vf):1.25V@150mA;直流反向耐压(Vr):100V;整流电流:150mA;反向恢复时间(trr):4ns;; LCSC Part Name: 电压:100V 电流:150mA; Supplier Part: C437156; Manufacturer: MDD(辰达半导体); Supplier Footprint: SOD-323; JLCPCB Part Class: 扩展库; Datasheet: https://atta.szlcsc.com/upload/public/pdf/source/20230823/12C4B88004F768DBC940AB716F9D26AA.pdf; Supplier: LCSC; Diode Configuration: 独立式; Forward Voltage (Vf@If): 1.25V@150mA; Reverse Voltage (Vr): 100V; Rectified Current: 150mA; Reverse Leakage Current: 25nA@20V; Reverse Recovery Time (trr): 4ns; Operating Temperature: -55℃~+150℃@(Tj)
SW1 SW2 = K9-1267T: 类型:微动开关;电路结构:单刀双掷;额定电流(DC):100mA;额定电压(DC):30V;额定电流(AC):-;额定电压(AC):-;机械寿命:300万次;; LCSC Part Name: 12.7*5.7*7.5mm 插件微动开关; Supplier Part: C107266; Manufacturer: 韩国韩荣; Supplier Footprint: 插件; JLCPCB Part Class: 扩展库; Datasheet: https://atta.szlcsc.com/upload/public/pdf/source/20170413/1492062748888.pdf; Supplier: LCSC; Type: 微动开关; Circuit: 单刀双掷; Switch Length: 12.7mm; Switch Width: 5.7mm; Switch Height: 7.5mm; Contact Current (DC): 100mA; Voltage Rating (DC): 30V; Mechanical Life: 300万次; Operating Temperature: -25℃~+85℃
U1-U14 U29-U42 U57-U68 U81-U88 U99-U107 = Yo-WS2812B-3528反贴雾状: Supplier Part: C9900003682; Supplier Footprint: LED-SMD_L3.2-W2.8-BR_DY-S35281; JLCPCB Part Class: 扩展库; Supplier: LCSC
U15-U28 U43-U56 U69-U80 U91-U98 U108-U116 = CPG151101S11-16_C41430893: 热插拔底座连接器 键盘配件; LCSC Part Name: 热插拔底座连接器 键盘配件; Supplier Part: C41430893; Manufacturer: HanElectricity(瀚源); Supplier Footprint: SMD,14.5x5.9mm; JLCPCB Part Class: 扩展库; Datasheet: https://atta.szlcsc.com/upload/public/pdf/source/20241016/CAB9C3DABBAD4306660C041376EEF732.pdf; Supplier: LCSC
U89 U90 = XL-3528RGBC-WS2812B: Supplier Part: C5440693; Manufacturer: XINGLIGHT(成兴光); Supplier Footprint: SMD-4P,3.5x2.8mm; JLCPCB Part Class: 扩展库; Datasheet: https://atta.szlcsc.com/upload/public/pdf/source/20240613/4CD4F2CA4289EE385C338CCDDE94EC30.pdf; Supplier: LCSC

## Nets
+3.3V: C58.1 C61.2 C63.2 C64.2 C65.2 C66.2 C67.2 C70.2 D60.1(C) FPC3.1 H1.1 LDO1.5(VOUT) R1.1 R2.2 R3.1 R5.1 SW4.1 SW4.2 U217.1(VBAT) U217.23(VDD) U217.35(VDD) U217.48(VDD)
+5V: C1.2 C2.2 C3.2 C4.2 C5.2 C6.2 C7.2 C8.2 C9.2 C10.2 C11.2 C12.2 C13.2 C14.2 C15.2 C16.2 C17.2 C18.2 C19.2 C20.2 C21.2 C22.2 C23.2 C24.2 C25.2 C26.2 C27.2 C28.2 C29.2 C30.2 C31.2 C32.2 C33.2 C34.2 C35.2 C36.2 C37.2 C38.2 C39.2 C40.2 C41.2 C42.2 C43.2 C44.2 C45.2 C46.2 C47.2 C48.2 C49.2 C50.2 C51.2 C52.2 C53.2 C54.2 C55.2 C56.2 C57.2 C68.2 C69.2 FPC1.6 FPC1.7 FPC1.8 LDO1.1(VIN) LDO1.3(CE) U1.1(VDD) U2.1(VDD) U3.1(VDD) U4.1(VDD) U5.1(VDD) U6.1(VDD) U7.1(VDD) U8.1(VDD) U9.1(VDD) U10.1(VDD) U11.1(VDD) U12.1(VDD) U13.1(VDD) U14.1(VDD) U29.1(VDD) U30.1(VDD) U31.1(VDD) U32.1(VDD) U33.1(VDD) U34.1(VDD) U35.1(VDD) U36.1(VDD) U37.1(VDD) U38.1(VDD) U39.1(VDD) U40.1(VDD) U41.1(VDD) U42.1(VDD) U57.1(VDD) U58.1(VDD) U59.1(VDD) U60.1(VDD) U61.1(VDD) U62.1(VDD) U63.1(VDD) U64.1(VDD) U65.1(VDD) U66.1(VDD) U67.1(VDD) U68.1(VDD) U81.1(VDD) U82.1(VDD) U83.1(VDD) U84.1(VDD) U85.1(VDD) U86.1(VDD) U87.1(VDD) U88.1(VDD) U89.3(VDD) U90.3(VDD) U99.1(VDD) U100.1(VDD) U101.1(VDD) U102.1(VDD) U103.1(VDD) U104.1(VDD) U105.1(VDD) U106.1(VDD) U107.1(VDD)
GND: C1.1 C2.1 C3.1 C4.1 C5.1 C6.1 C7.1 C8.1 C9.1 C10.1 C11.1 C12.1 C13.1 C14.1 C15.1 C16.1 C17.1 C18.1 C19.1 C20.1 C21.1 C22.1 C23.1 C24.1 C25.1 C26.1 C27.1 C28.1 C29.1 C30.1 C31.1 C32.1 C33.1 C34.1 C35.1 C36.1 C37.1 C38.1 C39.1 C40.1 C41.1 C42.1 C43.1 C44.1 C45.1 C46.1 C47.1 C48.1 C49.1 C50.1 C51.1 C52.1 C53.1 C54.1 C55.1 C56.1 C57.1 C58.2 C59.2 C60.2 C61.1 C62.1 C63.1 C64.1 C65.1 C66.1 C67.1 C68.1 C69.1 C70.1 C71.2 C72.2 C73.1 C74.2 D60.2(A) FPC1.1 FPC1.4 FPC1.5 FPC1.9 FPC1.10 FPC2.3 FPC2.4 FPC2.9 FPC2.10 FPC3.2 FPC3.3 FPC3.9 FPC3.10 FPC4.9 FPC4.10 H1.2 LDO1.2(VSS) LED1.1(K) R4.1 SW3.1 SW3.2 U1.3(GND) U2.3(GND) U3.3(GND) U4.3(GND) U5.3(GND) U6.3(GND) U7.3(GND) U8.3(GND) U9.3(GND) U10.3(GND) U11.3(GND) U12.3(GND) U13.3(GND) U14.3(GND) U29.3(GND) U30.3(GND) U31.3(GND) U32.3(GND) U33.3(GND) U34.3(GND) U35.3(GND) U36.3(GND) U37.3(GND) U38.3(GND) U39.3(GND) U40.3(GND) U41.3(GND) U42.3(GND) U57.3(GND) U58.3(GND) U59.3(GND) U60.3(GND) U61.3(GND) U62.3(GND) U63.3(GND) U64.3(GND) U65.3(GND) U66.3(GND) U67.3(GND) U68.3(GND) U81.3(GND) U82.3(GND) U83.3(GND) U84.3(GND) U85.3(GND) U86.3(GND) U87.3(GND) U88.3(GND) U89.1(GND) U90.1(GND) U99.3(GND) U100.3(GND) U101.3(GND) U102.3(GND) U103.3(GND) U104.3(GND) U105.3(GND) U106.3(GND) U107.3(GND) U217.49(EP) X1.2 X1.4
VDDA: C62.2 R3.2 U217.21(VDDA)
ADNS9800_CS: FPC3.7 U217.12(PA4)
ADNS9800_MOTION: FPC3.8 U217.11(PA3)
BOOT0: R4.2 SW4.3 U217.46(PB8-BOOT0)
COL1: D1.1(K) D15.1(K) D29.1(K) D41.1(K) D51.1(K) FPC2.7 U217.8(PA0)
COL2: D2.1(K) D16.1(K) FPC2.6 U217.9(PA1)
COL3: D3.1(K) D17.1(K) D30.1(K) FPC2.5 U217.10(PA2)
COL4: D4.1(K) D18.1(K) D31.1(K) D42.1(K) D52.1(K) FPC4.3 U217.16(PC4)
COL5: D5.1(K) D19.1(K) D32.1(K) D43.1(K) D53.1(K) FPC4.4 U217.17(PB0)
COL6: D6.1(K) D20.1(K) D33.1(K) D44.1(K) D54.1(K) FPC4.5 U217.18(PB1)
COL7: D7.1(K) D21.1(K) D34.1(K) D45.1(K) D55.1(K) FPC4.6 U217.19(PB2)
COL8: D8.1(K) D22.1(K) D35.1(K) D46.1(K) D56.1(K) FPC4.7 U217.45(PB7)
COL9: D9.1(K) D23.1(K) D36.1(K) D47.1(K) U217.43(PB5)
COL10: D10.1(K) D24.1(K) D37.1(K) D48.1(K) D57.1(K) U217.41(PB3)
COL11: D11.1(K) D25.1(K) D38.1(K) D49.1(C) U217.22(PB10)
COL12: D12.1(K) D26.1(K) U217.40(PC11)
COL13: D13.1(K) D27.1(K) D39.1(K) D58.1(K) U217.39(PC10)
COL14: D14.1(K) D28.1(K) D40.1(K) D50.1(C) D59.1(K) U217.38(PA15)
ENCODER_A: FPC2.2 U217.31(PA9)
ENCODER_B: FPC2.1 U217.32(PA10)
NRST: C60.1 R2.1 SW3.4 U217.7(PG10-NRST)
OSC32_IN: C72.1 U217.3(PC14-OSC32_IN) X2.2
OSC32_OUT: C74.1 U217.4(PC15-OSC32_OUT) X2.1
OSC_IN: C73.2 U217.5(PF0-OSC_IN) X1.3(OSC2)
OSC_OUT: C71.1 U217.6(PF1-OSC_OUT) X1.1(OSC1)
PA5: FPC3.6 U217.13(PA5)
PA6: FPC3.5 U217.14(PA6)
PA7: FPC3.4 U217.15(PA7)
PA8: FPC2.8 FPC4.1 U217.30(PA8)
PB4: U1.4(DIN) U217.42(PB4)
PB12: U15.1 U16.1 U17.1 U18.1 U19.1 U20.1 U21.1 U22.1 U23.1 U24.1 U25.1 U26.1 U27.1 U28.1 U217.25(PB12)
PB13: SW1.2(ON) SW2.2(ON) U91.1 U92.1 U93.1 U94.1 U95.1 U96.1 U97.1 U98.1 U217.26(PB13)
PB14: U108.1 U109.1 U110.1 U111.1 U112.1 U113.1 U114.1 U115.1 U116.1 U217.27(PB14)
PB15: U43.1 U44.1 U45.1 U46.1 U47.1 U48.1 U49.1 U50.1 U51.1 U52.1 U53.1 U54.1 U55.1 U56.1 U217.28(PB15)
PC6: U69.1 U70.1 U71.1 U72.1 U73.1 U74.1 U75.1 U76.1 U77.1 U78.1 U79.1 U80.1 U217.29(PC6)
SWCLK: H1.4 U217.37(PA14)
SWDIO: H1.3 U217.36(PA13)
USB_DM: FPC1.2 U217.33(PA11)
USB_DP: FPC1.3 U217.34(PA12)
VREF: C59.1 R1.2 U217.20(VREF+)
WS2812_2: U14.2(DOUT) U29.4(DIN)
WS2812_3: U42.2(DOUT) U57.4(DIN)
WS2812_4: U68.2(DOUT) U81.4(DIN)
WS2812_5: U90.4(DO) U99.4(DIN)
$2N52420: D1.2(A) U15.2
$2N52574: D2.2(A) U16.2
$2N52728: D3.2(A) U17.2
$2N52882: D4.2(A) U18.2
$2N53036: D5.2(A) U19.2
$2N53190: D6.2(A) U20.2
$2N53344: D7.2(A) U21.2
$2N53498: D8.2(A) U22.2
$2N53652: D9.2(A) U23.2
$2N53806: D10.2(A) U24.2
$2N53960: D11.2(A) U25.2
$2N54114: D12.2(A) U26.2
$2N54268: D13.2(A) U27.2
$2N54422: D14.2(A) U28.2
$2N54730: D15.2(A) U43.2
$2N56528: D16.2(A) U44.2
$2N56545: D17.2(A) U45.2
$2N56562: D18.2(A) U46.2
$2N56579: D19.2(A) U47.2
$2N56596: D20.2(A) U48.2
$2N56613: D21.2(A) U49.2
$2N56630: D22.2(A) U50.2
$2N56647: D23.2(A) U51.2
$2N56664: D24.2(A) U52.2
$2N56681: D25.2(A) U53.2
$2N56698: D26.2(A) U54.2
$2N56715: D27.2(A) U55.2
$2N56732: D28.2(A) U56.2
$2N56886: D29.2(A) U69.2
$2N57040: D41.2(A) U91.2
$2N57194: D51.2(A) U108.2
$2N58611: D36.2(A) U76.2
$2N58622: D37.2(A) U77.2
$2N58629: D38.2(A) U78.2
$2N58656: D34.2(A) U74.2
$2N58658: D35.2(A) U75.2
$2N58705: D33.2(A) U73.2
$2N58707: D32.2(A) U72.2
$2N58712: D30.2(A) U70.2
$2N58731: D31.2(A) U71.2
$2N59025: D39.2(A) U79.2
$2N59042: D40.2(A) U80.2
$2N60018: D42.2(A) U92.2
$2N60035: D43.2(A) U93.2
$2N60052: D44.2(A) U94.2
$2N60069: D45.2(A) U95.2
$2N60086: D46.2(A) U96.2
$2N60103: D47.2(A) U97.2
$2N60120: D48.2(A) U98.2
$2N61096: D52.2(A) U109.2
$2N61113: D53.2(A) U110.2
$2N61130: D54.2(A) U111.2
$2N61147: D55.2(A) U112.2
$2N61164: D56.2(A) U113.2
$2N61198: D57.2(A) U114.2
$2N61797: D58.2(A) U115.2
$2N61814: D59.2(A) U116.2
$2N61956: D49.2(A) SW1.3(NC)
$2N63413: U1.2(DOUT) U2.4(DIN)
$2N63429: U2.2(DOUT) U3.4(DIN)
$2N63438: U3.2(DOUT) U4.4(DIN)
$2N63444: U4.2(DOUT) U5.4(DIN)
$2N63454: U5.2(DOUT) U6.4(DIN)
$2N63464: U6.2(DOUT) U7.4(DIN)
$2N63474: U7.2(DOUT) U8.4(DIN)
$2N63481: U8.2(DOUT) U9.4(DIN)
$2N63487: U9.2(DOUT) U10.4(DIN)
$2N63494: U10.2(DOUT) U11.4(DIN)
$2N63501: U11.2(DOUT) U12.4(DIN)
$2N63511: U12.2(DOUT) U13.4(DIN)
$2N63518: U13.2(DOUT) U14.4(DIN)
$2N63533: U29.2(DOUT) U30.4(DIN)
$2N63539: U30.2(DOUT) U31.4(DIN)
$2N63549: U31.2(DOUT) U32.4(DIN)
$2N63556: U32.2(DOUT) U33.4(DIN)
$2N63563: U33.2(DOUT) U34.4(DIN)
$2N63570: U34.2(DOUT) U35.4(DIN)
$2N63577: U35.2(DOUT) U36.4(DIN)
$2N63587: U36.2(DOUT) U37.4(DIN)
$2N63594: U37.2(DOUT) U38.4(DIN)
$2N63602: U38.2(DOUT) U39.4(DIN)
$2N63608: U39.2(DOUT) U40.4(DIN)
$2N63615: U40.2(DOUT) U41.4(DIN)
$2N63622: U41.2(DOUT) U42.4(DIN)
$2N63634: U57.2(DOUT) U58.4(DIN)
$2N63640: U58.2(DOUT) U59.4(DIN)
$2N63646: U59.2(DOUT) U60.4(DIN)
$2N63652: U60.2(DOUT) U61.4(DIN)
$2N63658: U61.2(DOUT) U62.4(DIN)
$2N63664: U62.2(DOUT) U63.4(DIN)
$2N63670: U63.2(DOUT) U64.4(DIN)
$2N63677: U64.2(DOUT) U65.4(DIN)
$2N63684: U65.2(DOUT) U66.4(DIN)
$2N63700: U66.2(DOUT) U67.4(DIN)
$2N63707: U67.2(DOUT) U68.4(DIN)
$2N63719: U81.2(DOUT) U82.4(DIN)
$2N63725: U82.2(DOUT) U83.4(DIN)
$2N63731: U83.2(DOUT) U84.4(DIN)
$2N63738: U84.2(DOUT) U85.4(DIN)
$2N63745: U85.2(DOUT) U86.4(DIN)
$2N63755: U86.2(DOUT) U87.4(DIN)
$2N63762: U87.2(DOUT) U88.4(DIN)
$2N63769: U88.2(DOUT) U89.2(DI)
$2N63925: D50.2(A) SW2.3(NC)
$2N64130: U89.4(DO) U90.2(DI)
$2N64636: U99.2(DOUT) U100.4(DIN)
$2N64642: U100.2(DOUT) U101.4(DIN)
$2N64649: U101.2(DOUT) U102.4(DIN)
$2N64656: U102.2(DOUT) U103.4(DIN)
$2N64663: U103.2(DOUT) U104.4(DIN)
$2N64670: U104.2(DOUT) U105.4(DIN)
$2N64677: U105.2(DOUT) U106.4(DIN)
$2N64684: U106.2(DOUT) U107.4(DIN)
$4N2830: LED1.2(A) R5.2

Not connected (* = marked no-connect by the designer): FPC4 2* 8*; LDO1 4(NC)*; SW1 1(C)*; SW2 1(C)*; SW3 3*; SW4 4*; U107 2(DOUT)*; U217 2(PC13)* 24(PB11)* 44(PB6)* 47(PB9)*

## Notes on the sheets
sheet 2
- Type-C
- 主控
- BOOT & RESET
- 滚轮
- 电源
- 轨迹球
- 方向
- 晶振
- One-Handed Keyboard_ML
